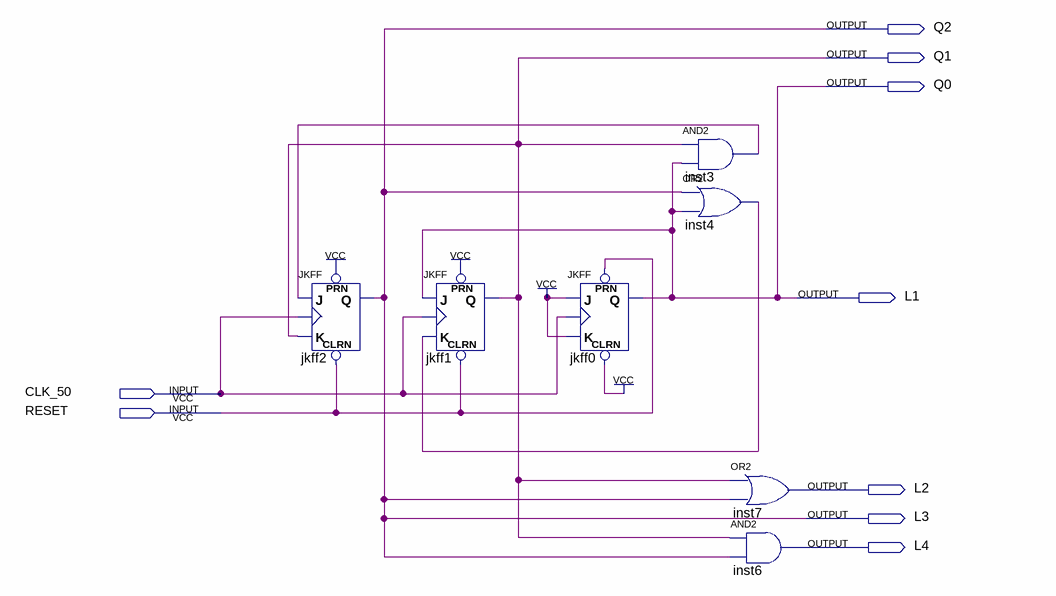
[diagram p0: schematic sheet]
// Quartus schematic dice_jk.bdf as structural Verilog: 7 symbols, 9 pins
module dice_jk (
  input  CLK_50,
  input  RESET,
  output Q2,
  output Q1,
  output Q0,
  output L1,
  output L2,
  output L3,
  output L4
);

  wire inst3_out, inst4_out;

  JKFF jkff2 (.PRN(1'b1), .CLRN(RESET), .K(Q1), .J(inst3_out), .CLK(CLK_50), .Q(L3));
  JKFF jkff1 (.PRN(1'b1), .CLRN(RESET), .K(inst4_out), .J(L1), .CLK(CLK_50), .Q(Q1));
  JKFF jkff0 (.PRN(RESET), .CLRN(1'b1), .K(1'b1), .J(1'b1), .CLK(CLK_50), .Q(L1));
  and inst3 (inst3_out, Q1, L1);
  or inst4 (inst4_out, L3, L1);
  or inst7 (L2, Q1, L3);
  and inst6 (L4, Q1, L3);

  assign Q0 = L1;
  assign Q2 = L3;
endmodule
